# EAGLE design RGB Matrix (EAGLE 6.4)
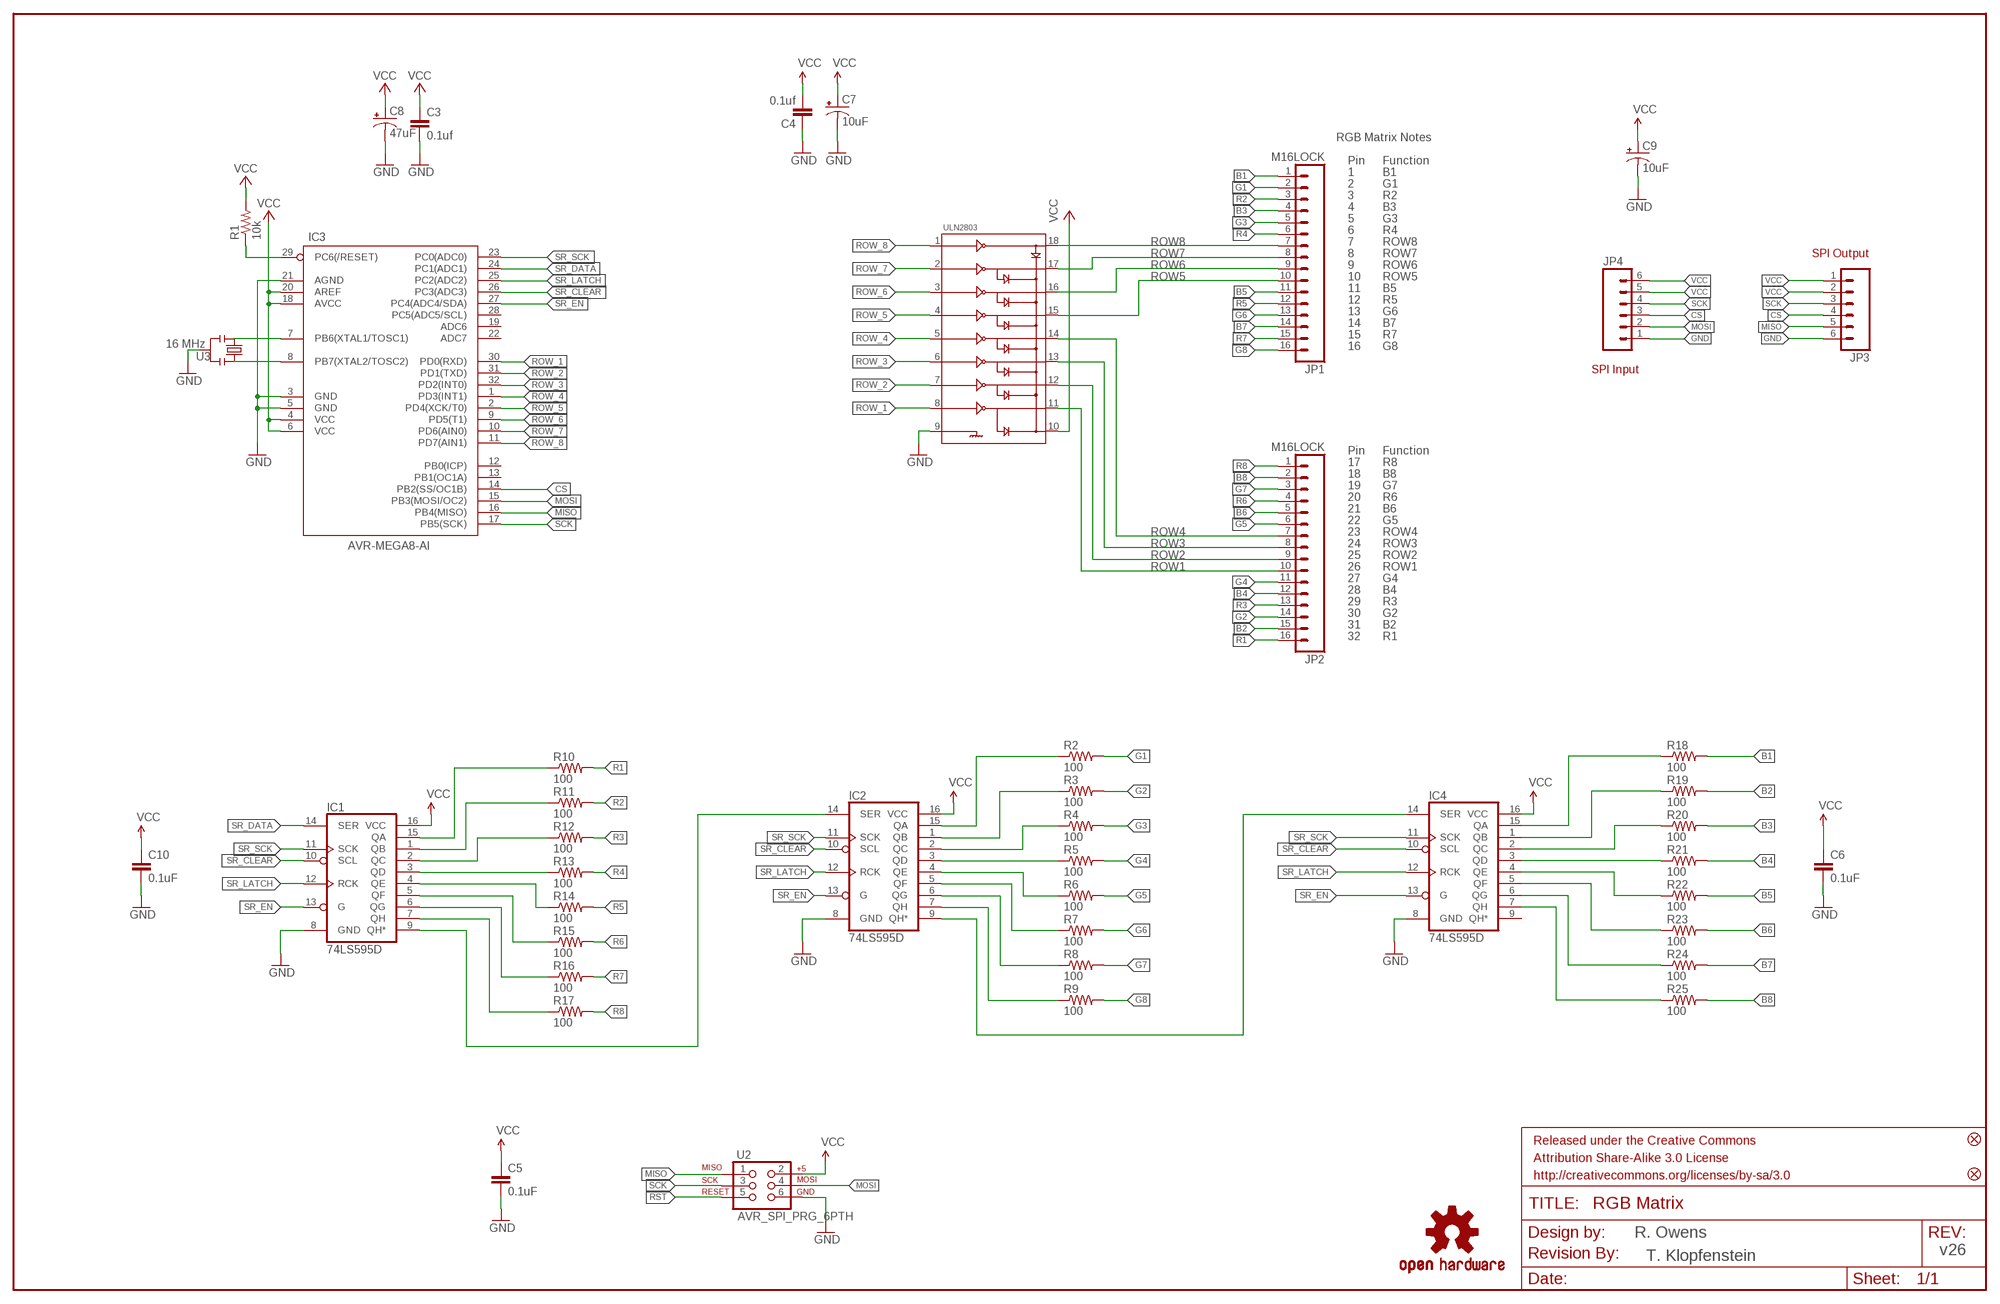
[diagram p0: schematic, sheet 1]

## Parts
C3  0.1uf  CAP0603-CAP  [0603-CAP]
C4  0.1uf  CAP0603-CAP  [0603-CAP]
C5  0.1uF  CAP0603-CAP  [0603-CAP]
C6  0.1uF  CAP0603-CAP  [0603-CAP]
C7  10uF  CAP_POL1206  [EIA3216]
C8  47uF  CAP_POL3528  [EIA3528]
C9  10uF  CAP_POL1206  [EIA3216]
C10  0.1uF  CAP0603-CAP  [0603-CAP]
FRAME1  FRAME-LEDGER  [CREATIVE_COMMONS]
IC1  74LS595D  [SO16]
IC2  74LS595D  [SO16]
IC3  AVR-MEGA8-AI  [TQFP32-08]
IC4  74LS595D  [SO16]
JP1  M16LOCK  [1X16_LOCK]
JP2  M16LOCK  [1X16_LOCK]
JP3  M06SMD  [1X06-SMD]
JP4  M06LOCK  [1X06_LOCK]
LOGO1  OSHW-LOGOL  [OSHW-LOGO-L]
R1  10k  RESISTOR0603-RES  [0603-RES]
R2  100  RESISTOR0603-RES  [0603-RES]
R3  100  RESISTOR0603-RES  [0603-RES]
R4  100  RESISTOR0603-RES  [0603-RES]
R5  100  RESISTOR0603-RES  [0603-RES]
R6  100  RESISTOR0603-RES  [0603-RES]
R7  100  RESISTOR0603-RES  [0603-RES]
R8  100  RESISTOR0603-RES  [0603-RES]
R9  100  RESISTOR0603-RES  [0603-RES]
R10  100  RESISTOR0603-RES  [0603-RES]
R11  100  RESISTOR0603-RES  [0603-RES]
R12  100  RESISTOR0603-RES  [0603-RES]
R13  100  RESISTOR0603-RES  [0603-RES]
R14  100  RESISTOR0603-RES  [0603-RES]
R15  100  RESISTOR0603-RES  [0603-RES]
R16  100  RESISTOR0603-RES  [0603-RES]
R17  100  RESISTOR0603-RES  [0603-RES]
R18  100  RESISTOR0603-RES  [0603-RES]
R19  100  RESISTOR0603-RES  [0603-RES]
R20  100  RESISTOR0603-RES  [0603-RES]
R21  100  RESISTOR0603-RES  [0603-RES]
R22  100  RESISTOR0603-RES  [0603-RES]
R23  100  RESISTOR0603-RES  [0603-RES]
R24  100  RESISTOR0603-RES  [0603-RES]
R25  100  RESISTOR0603-RES  [0603-RES]
U2  AVR_SPI_PRG_6PTH  [2X3]
U3  16 MHz  RESONATORSMD  [RESONATOR-SMD]
U$1  FIDUCIAL1X2  [FIDUCIAL-1X2]
U$2  REVISION  [REVISION]
U$3  FIDUCIAL1X2  [FIDUCIAL-1X2]
ULN2803  ULN2803SOICW  [SO18L]

## Nets
B1: JP1.1 R18.2
B2: JP2.15 R19.2
B3: JP1.4 R20.2
B4: JP2.12 R21.2
B5: JP1.11 R22.2
B6: JP2.5 R23.2
B7: JP1.14 R24.2
B8: JP2.2 R25.2
CS: IC3.14(PB2(SS/OC1B)) JP3.4 JP4.3
G1: JP1.2 R2.2
G2: JP2.14 R3.2
G3: JP1.5 R4.2
G4: JP2.11 R5.2
G5: JP2.6 R6.2
G6: JP1.13 R7.2
G7: JP2.3 R8.2
G8: JP1.16 R9.2
GND [power]: C3.2 C4.1 C5.2 C6.2 C7.C(-) C8.C(-) C9.C(-) C10.2 IC1.8(GND) IC2.8(GND) IC3.3(GND) IC3.5(GND) IC3.21(AGND) IC4.8(GND) JP3.6 JP4.1 U2.6 U3.2 ULN2803.9
MISO: IC3.16(PB4(MISO)) JP3.5 U2.1
MOSI: IC3.15(PB3(MOSI/OC2)) JP4.2 U2.4
N$1: IC3.7(PB6(XTAL1/TOSC1)) U3.1
N$2: IC3.8(PB7(XTAL2/TOSC2)) U3.3
N$11: IC1.9(QH*) IC2.14(SER)
N$12: IC1.15(QA) R10.1
N$13: IC1.1(QB) R11.1
N$14: IC1.2(QC) R12.1
N$15: IC1.3(QD) R13.1
N$16: IC2.9(QH*) IC4.14(SER)
N$18: IC1.4(QE) R14.1
N$19: IC1.5(QF) R15.1
N$20: IC1.6(QG) R16.1
N$21: IC1.7(QH) R17.1
N$22: IC2.15(QA) R2.1
N$23: IC2.1(QB) R3.1
N$24: IC2.2(QC) R4.1
N$25: IC2.3(QD) R5.1
N$26: IC2.4(QE) R6.1
N$27: IC2.5(QF) R7.1
N$28: IC2.6(QG) R8.1
N$29: IC2.7(QH) R9.1
N$32: IC4.15(QA) R18.1
N$33: IC4.1(QB) R19.1
N$34: IC4.2(QC) R20.1
N$35: IC4.3(QD) R21.1
N$36: IC4.4(QE) R22.1
N$37: IC4.5(QF) R23.1
N$38: IC4.6(QG) R24.1
N$39: IC4.7(QH) R25.1
R1: JP2.16 R10.2
R2: JP1.3 R11.2
R3: JP2.13 R12.2
R4: JP1.6 R13.2
R5: JP1.12 R14.2
R6: JP2.4 R15.2
R7: JP1.15 R16.2
R8: JP2.1 R17.2
ROW1 [power]: JP2.10 ULN2803.11
ROW2 [power]: JP2.9 ULN2803.12
ROW3 [power]: JP2.8 ULN2803.13
ROW4 [power]: JP2.7 ULN2803.14
ROW5 [power]: JP1.10 ULN2803.15
ROW6 [power]: JP1.9 ULN2803.16
ROW7 [power]: JP1.8 ULN2803.17
ROW8 [power]: JP1.7 ULN2803.18
ROW_1: IC3.30(PD0(RXD)) ULN2803.8
ROW_2: IC3.31(PD1(TXD)) ULN2803.7
ROW_3: IC3.32(PD2(INT0)) ULN2803.6
ROW_4: IC3.1(PD3(INT1)) ULN2803.5
ROW_5: IC3.2(PD4(XCK/T0)) ULN2803.4
ROW_6: IC3.9(PD5(T1)) ULN2803.3
ROW_7: IC3.10(PD6(AIN0)) ULN2803.2
ROW_8: IC3.11(PD7(AIN1)) ULN2803.1
RST: IC3.29(PC6(/RESET)) R1.1 U2.5
SCK: IC3.17(PB5(SCK)) JP3.3 JP4.4 U2.3
SR_CLEAR: IC1.10(SCL) IC2.10(SCL) IC3.26(PC3(ADC3)) IC4.10(SCL)
SR_DATA: IC1.14(SER) IC3.24(PC1(ADC1))
SR_EN: IC1.13(G) IC2.13(G) IC3.27(PC4(ADC4/SDA)) IC4.13(G)
SR_LATCH: IC1.12(RCK) IC2.12(RCK) IC3.25(PC2(ADC2)) IC4.12(RCK)
SR_SCK: IC1.11(SCK) IC2.11(SCK) IC3.23(PC0(ADC0)) IC4.11(SCK)
VCC [power]: C3.1 C4.2 C5.1 C6.1 C7.A(+) C8.A(+) C9.A(+) C10.1 IC1.16(VCC) IC2.16(VCC) IC3.4(VCC) IC3.6(VCC) IC3.18(AVCC) IC3.20(AREF) IC4.16(VCC) JP3.1 JP3.2 JP4.5 JP4.6 R1.2 U2.2 ULN2803.10
Unconnected: IC3.12(PB0(ICP)) IC3.13(PB1(OC1A)) IC3.19(ADC6) IC3.22(ADC7) IC3.28(PC5(ADC5/SCL)) IC4.9(QH*)

## Notes on the sheet
- RGB Matrix Notes
- Pin | Function
- 1 | B1
- 2 | G1
- 3 | R2
- 4 | B3
- 5 | G3
- 6 | R4
- 7 | ROW8
- 8 | ROW7 | SPI Output
- 9 | ROW6
- 10 | ROW5
- 11 | B5
- 12 | R5
- 13 | G6
- 14 | B7
- 15 | R7
- 16 | G8
- SPI Input
- Pin | Function
- 17 | R8
- 18 | B8
- 19 | G7
- 20 | R6
- 21 | B6
- 22 | G5
- 23 | ROW4
- 24 | ROW3
- 25 | ROW2
- 26 | ROW1
- 27 | G4
- 28 | B4
- 29 | R3
- 30 | G2
- 31 | B2
- 32 | R1
- R. Owens
- v26
- T. Klopfenstein

## Library data of the parts
C3-C6 C10 = SparkFun-Passives:CAP: Capacitor Standard 0603 ceramic capacitor, and 0.1" leaded capacitor.
C7-C9 = SparkFun:CAP_POL: Capacitor Polarized These are standard SMD and PTH capacitors. Normally 10uF, 47uF, and 100uF in electrolytic and tantalum varieties. Always verify the external diameter of the through hole cap, it varies with capacity, voltage, and manufacturer. The EIA devices should be standard.
FRAME1 = SparkFun-Aesthetics:FRAME-LEDGER: Schematic Frame Standard 11x14 US Ledger frame
IC1 IC2 IC4 = SparkFun:74*595: 8-bit SHIFT REGISTER, output latch
IC3 = SparkFun:AVR-MEGA8: MICROCONTROLLER 8 Kbytes FLASH 1 kbytes SRAM 512 bytes EEPROM USART 6-channel 10 bit ADC 2-channel 8 bit ADC
JP1 JP2 = SparkFun-Connectors:M16: 1x16 .1" header
JP3 = SparkFun:M06: Header 6 Standard 6-pin 0.1" header. Use with straight break away headers (SKU : PRT-00116), right angle break away headers (PRT-00553), swiss pins (PRT-00743), machine pins (PRT-00117), and female headers (PRT-00115). Molex polarized connector foot print use with SKU : PRT-08094 with associated crimp pins and housings. NOTES ON THE VARIANTS LOCK and LOCK_LONGPADS... This footprint was designed to help hold the alignment of a through-hole component (i.e. 6-pin header) while soldering it into place. You may notice that each hole has been shifted either up or down by 0.005 of an inch from it's more standard position (which is a perfectly straight line). This slight alteration caused the pins (the squares in the middle) to touch the edges of the holes. Because they are alternating, it causes a "brace" to hold the component in place. 0.005 has proven to be the perfect amount of "off-center" position when using our standard breakaway headers. Although looks a little odd when you look at the bare footprint, once you have a header in there, the alteration is very hard to notice. Also, if you push a header all the way into place, it is covered up entirely on the bottom side. This idea of altering the position of holes to aid alignment will be further integrated into the Sparkfun Library for other footprints. It can help hold any component with 3 or more connection pins.
JP4 = SparkFun-Connectors:M06: Header 6 Standard 6-pin 0.1" header. Use with straight break away headers (SKU : PRT-00116), right angle break away headers (PRT-00553), swiss pins (PRT-00743), machine pins (PRT-00117), and female headers (PRT-00115). Molex polarized connector foot print use with SKU : PRT-08094 with associated crimp pins and housings. NOTES ON THE VARIANTS LOCK and LOCK_LONGPADS... This footprint was designed to help hold the alignment of a through-hole component (i.e. 6-pin header) while soldering it into place. You may notice that each hole has been shifted either up or down by 0.005 of an inch from it's more standard position (which is a perfectly straight line). This slight alteration caused the pins (the squares in the middle) to touch the edges of the holes. Because they are alternating, it causes a "brace" to hold the component in place. 0.005 has proven to be the perfect amount of "off-center" position when using our standard breakaway headers. Although looks a little odd when you look at the bare footprint, once you have a header in there, the alteration is very hard to notice. Also, if you push a header all the way into place, it is covered up entirely on the bottom side. This idea of altering the position of holes to aid alignment will be further integrated into the Sparkfun Library for other footprints. It can help hold any component with 3 or more connection pins.
LOGO1 = SparkFun-Aesthetics:OSHW-LOGO: Open Source Hardware Logo This logo indicates the piece of hardware it is found on incorporates a OSHW license and/or adheres to the definition of open source hardware found here: http://freedomdefined.org/OSHW
R1-R25 = SparkFun-Passives:RESISTOR: Resistor Basic schematic elements and footprints for 0603, 1206, and PTH resistors.
U2 = SparkFun:AVR_SPI_PRG_6: AVR ISP 6 Pin This is the reduced ISP connector for AVR programming. Common on Arduino. This footprint will take up less PCB space and can be used with a 10-pin to 6-pin adapter such as SKU: BOB-08508
U3 = SparkFun:RESONATOR: Resonator Small SMD resonator. This is the itty bitty 10/20MHz resonators with built in caps. CSTCE10M0G55 and CSTCE20M0V53. Footprint has been reviewed closely but hasn't been tested yet.
U$1 U$3 = SparkFun:FIDUCIAL: Fiducial Alignment Points Various fiducial points for machine vision alignment.
U$2 = SparkFun-Aesthetics:REVISION
ULN2803 = SparkFun:ULN2803: Darlington Driver ULN2803 Darlington array. 500mA max per channel, 8-channel package. Spark Fun Electronics SKU : COM-00312

## Net classes
0 default: width 0.203 mm
1 power: width 0.203 mm

## Board
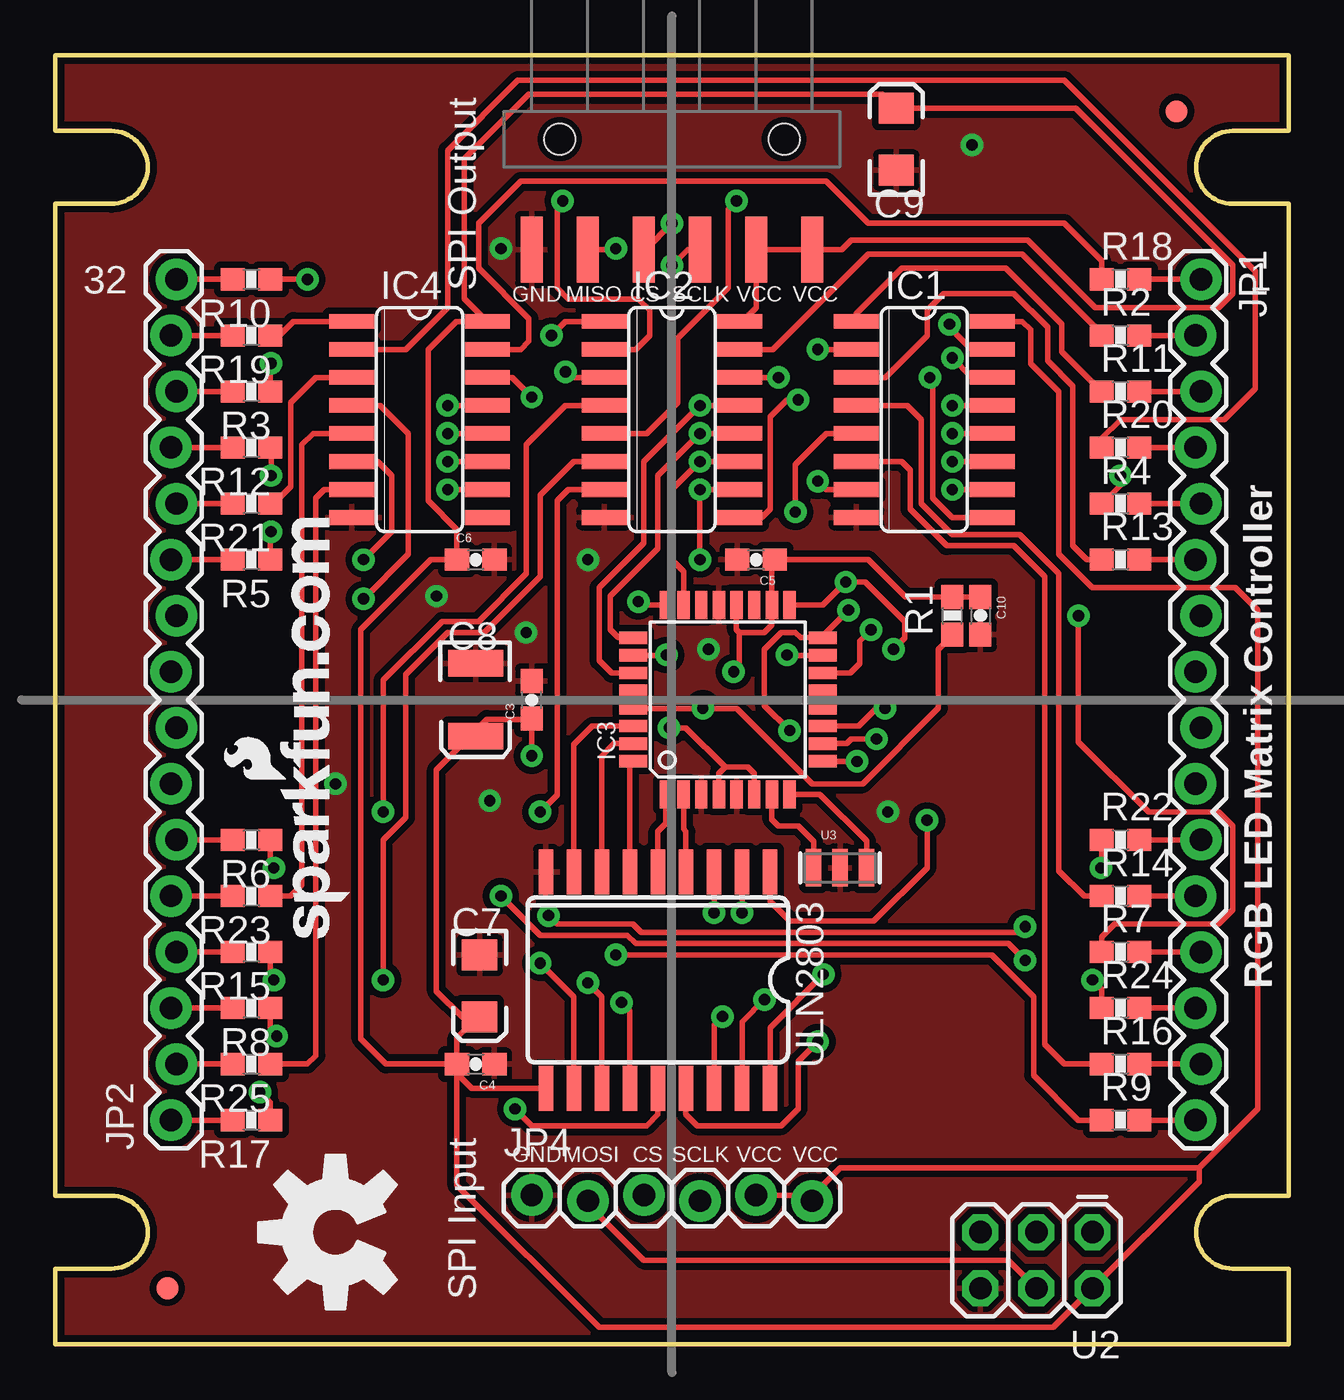
[diagram p1: board, top side]
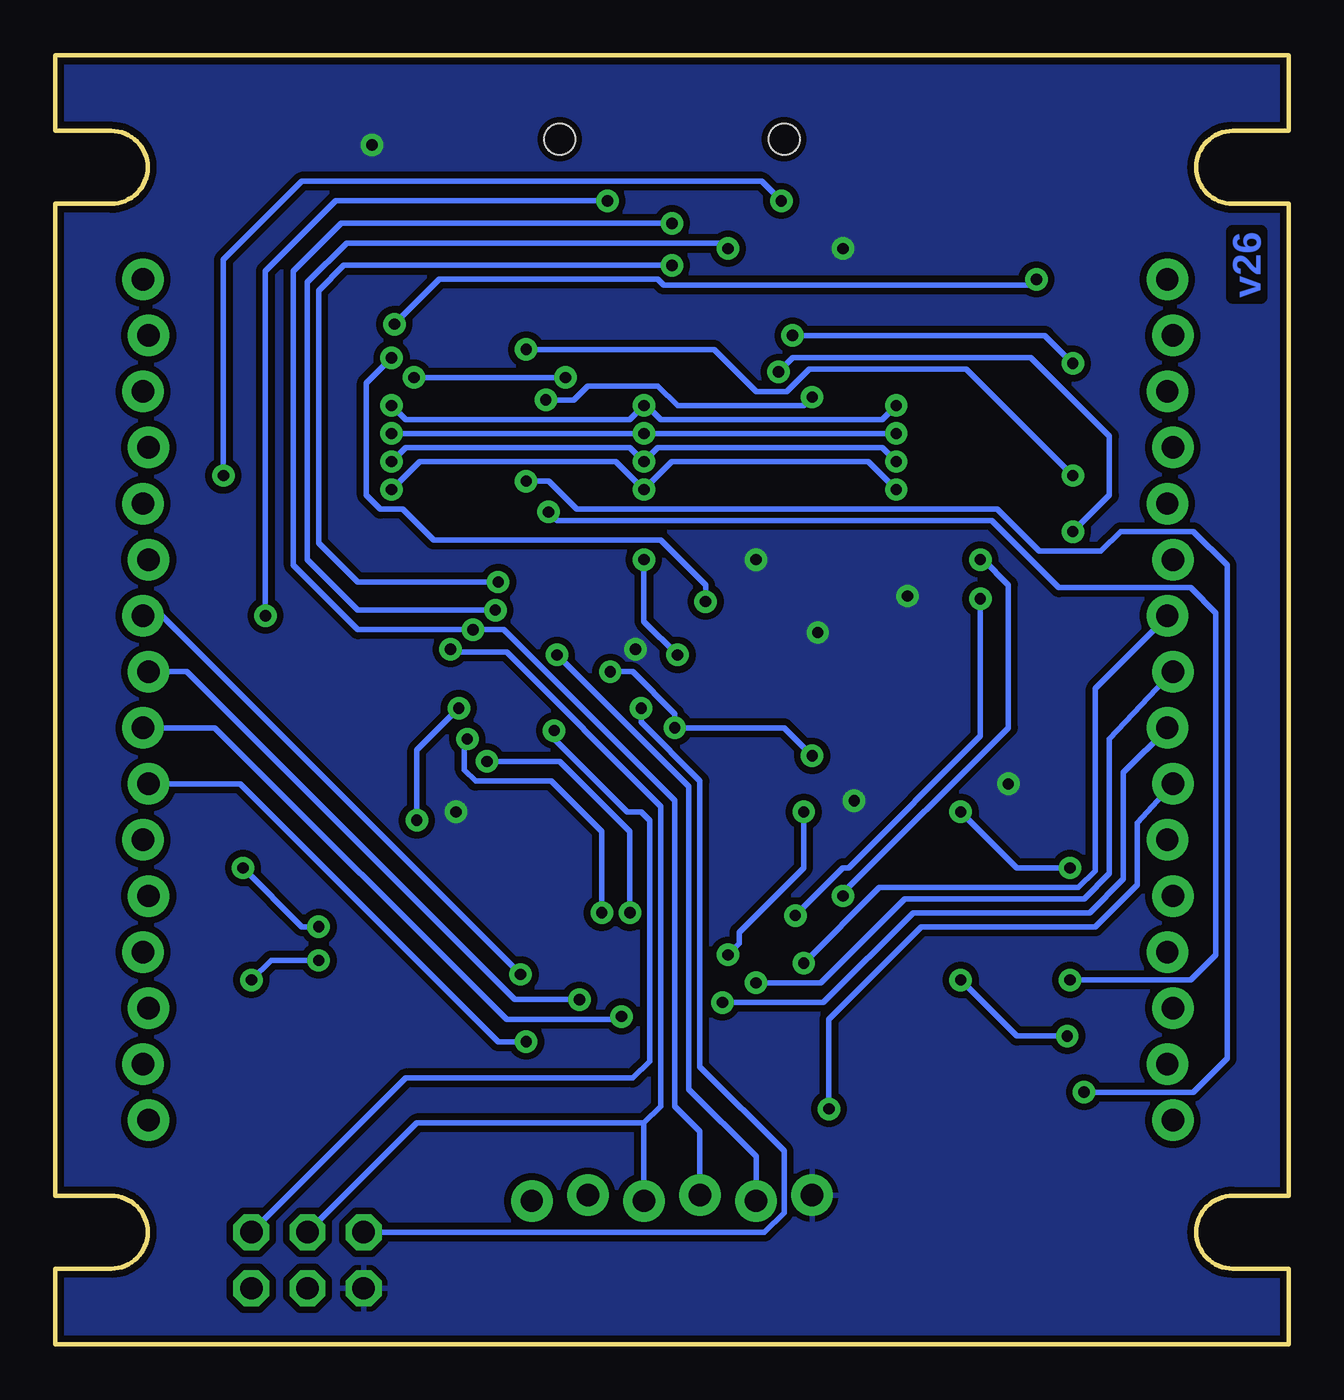
[diagram p2: board, bottom side, seen from below]

Size 55.88 x 58.42 mm. Coordinates in mm from the lower left corner, seen from the top.
Outline: 55.88,0 55.88,3.43 53.34,3.43 arc-180 53.34,6.73 55.88,6.73 55.88,51.69 53.34,51.69 arc-180 53.34,54.99 55.88,54.99 55.88,58.42 0,58.42 0,54.99 2.54,54.99 arc-180 2.54,51.69 0,51.69 0,6.73 2.54,6.73 arc-180 2.54,3.43 0,3.43 0,0 55.88,0
Copper layers (1*16): Top 0.035mm / dielectric 1.5mm / Bottom 0.035mm
Design rules "SparkFun": minimum track width 8mil, minimum drill 20mil, track to track 8mil, track to pad 8mil, pad to pad 8mil, via to via 8mil, smd to smd 8mil, copper to edge 10mil, drill to drill 8mil, minimum pad ring 12mil, minimum via ring 10mil, stop-mask expansion 4mil, vias tented up to drill 25mil, thermal gap 10mil

### Footprints (pad centres in the part's own frame; a part is rotated, then mirrored left to right if it is on the bottom)
0603-CAP = smd 1.1 x 1: 1 -0.85,0; 2 0.85,0
EIA3216 = smd 1.4 x 1.6: A 1.4,0; C -1.4,0
EIA3528 = smd 1.2 x 2.5: A 1.65,0; C -1.65,0
SO16 = smd 0.66 x 2.032: 1 -4.445,-3.073; 2 -3.175,-3.073; 3 -1.905,-3.073; 4 -0.635,-3.073; 5 0.635,-3.073; 6 1.905,-3.073; 7 3.175,-3.073; 8 4.445,-3.073; 9 4.445,3.073; 10 3.175,3.073; 11 1.905,3.073; 12 0.635,3.073; 13 -0.635,3.073; 14 -1.905,3.073; 15 -3.175,3.073; 16 -4.445,3.073
TQFP32-08 = smd 1.27 x 0.559: 1 -4.293,2.8; 2 -4.293,2; 3 -4.293,1.2; 4 -4.293,0.4; 5 -4.293,-0.4; 6 -4.293,-1.2; 7 -4.293,-2; 8 -4.293,-2.8; 17 4.293,-2.8; 18 4.293,-2; 19 4.293,-1.2; 20 4.293,-0.4; 21 4.293,0.4; 22 4.293,1.2; 23 4.293,2; 24 4.293,2.8 | smd 0.559 x 1.27: 9 -2.8,-4.293; 10 -2,-4.293; 11 -1.2,-4.293; 12 -0.4,-4.293; 13 0.4,-4.293; 14 1.2,-4.293; 15 2,-4.293; 16 2.8,-4.293; 25 2.8,4.293; 26 2,4.293; 27 1.2,4.293; 28 0.4,4.293; 29 -0.4,4.293; 30 -1.2,4.293; 31 -2,4.293; 32 -2.8,4.293
1X16_LOCK = drill 1.016 pad 1.88: 1 0,0.127; 2 2.54,-0.127; 3 5.08,0.127; 4 7.62,-0.127; 5 10.16,0.127; 6 12.7,-0.127; 7 15.24,0.127; 8 17.78,-0.127; 9 20.32,0.127; 10 22.86,-0.127; 11 25.4,0.127; 12 27.94,-0.127; 13 30.48,0.127; 14 33.02,-0.127; 15 35.56,0.127; 16 38.1,-0.127
1X06-SMD = smd 1 x 3: 1 -6.35,5; 2 -3.81,5; 3 -1.27,5; 4 1.27,5; 5 3.81,5; 6 6.35,5 | hole 1.4: -5.08,0; 5.08,0
1X06_LOCK = drill 1.016 pad 1.88: 1 0,0; 2 2.54,-0.254; 3 5.08,0; 4 7.62,-0.254; 5 10.16,0; 6 12.7,-0.254
0603-RES = smd 1.1 x 1: 1 -0.85,0; 2 0.85,0
2X3 = drill 1.016 octagon: 1 0,0; 2 0,2.54; 3 2.54,0; 4 2.54,2.54; 5 5.08,0; 6 5.08,2.54
RESONATOR-SMD = smd 0.7 x 1.7: 1 -1.2,0; 2 0,0; 3 1.2,0
FIDUCIAL-1X2 = smd 1 x 1: 1 0,0
SO18L = smd 0.66 x 2.032: 1 -0.635,-4.902; 2 0.635,-4.902; 3 1.905,-4.902; 4 3.175,-4.902; 5 4.445,-4.902; 6 5.715,-4.902; 7 6.985,-4.902; 8 8.255,-4.902; 9 9.525,-4.902; 10 9.525,4.902; 11 8.255,4.902; 12 6.985,4.902; 13 5.715,4.902; 14 4.445,4.902; 15 3.175,4.902; 16 1.905,4.902; 17 0.635,4.902; 18 -0.635,4.902

### Placement (x,y rotation side)
C3  21.59,29.21 90 top
C4  19.05,12.7 180 top
C5  31.75,35.56 180 top
C6  19.05,35.56 0 top
C7  19.23,16.24 270 top
C8  19.05,29.21 270 top
C9  38.1,54.61 90 top
C10  41.91,33.02 270 top
FRAME1  -2.07,-16.51 0 top  (outside the outline)
IC1  39.37,41.91 270 top
IC2  27.94,41.91 270 top
IC3  30.47,29.22 90 top
IC4  16.51,41.91 270 top
JP1  51.77,48.26 270 top
JP2  5.38,10.16 90 top
JP3  27.94,54.61 180 top
JP4  21.59,6.76 0 top
LOGO1  12.7,5.08 90 top
R1  40.64,33.02 90 top
R2  48.26,45.72 0 top
R3  8.89,43.18 180 top
R4  48.26,38.1 0 top
R5  8.89,35.56 180 top
R6  8.89,22.86 180 top
R7  48.26,17.78 0 top
R8  8.89,15.24 180 top
R9  48.26,10.16 0 top
R10  8.89,48.26 180 top
R11  48.26,43.18 0 top
R12  8.89,40.64 180 top
R13  48.26,35.56 0 top
R14  48.26,20.32 0 top
R15  8.89,17.78 180 top
R16  48.26,12.7 0 top
R17  8.89,10.16 180 top
R18  48.26,48.26 0 top
R19  8.89,45.72 180 top
R20  48.26,40.64 0 top
R21  8.89,38.1 180 top
R22  48.26,22.86 0 top
R23  8.89,20.32 180 top
R24  48.26,15.24 0 top
R25  8.89,12.7 180 top
U2  46.99,5.08 180 top
U3  35.56,21.59 0 top
U$1  5.08,2.54 90 top
U$2  8.89,-20.32 0 top  (outside the outline)
U$3  50.8,55.88 90 top
U$8  [SFE-NEW-WEBLOGO]  13.34,18.41 90 top
ULN2803  31.75,16.51 180 top

### Tracks (layer width: path | path; a pad name or v marks a point on that pad's centre or on a via)
B1
  Top 0.254: R18.2 JP1.1
B2
  Top 0.254: JP2.15 R19.2
B3
  Top 0.254: R20.2 JP1.4
B4
  Top 0.254: JP2.12 R21.2
B5
  Top 0.254: R22.2 JP1.11
B6
  Top 0.254: JP2.5 R23.2
B7
  Top 0.254: R24.2 JP1.14
B8
  Top 0.254: JP2.2 R25.2
CS  (via drill 0.51)
  Top 0.254: IC3.14 36.01,30.42 36.45,30.86 36.45,31.88 v36.96,32.38 | JP3.4 26.75,49.61 v27.94,50.8
  Bottom 0.254: v27.94,50.8 42.93,50.8 45.09,48.64 45.09,35.31 42.16,32.38 v36.96,32.38 35.56,32.38 27.81,24.64 27.81,10.79 26.67,9.65 JP4.3
G1
  Top 0.254: R2.2 JP1.2
G2
  Top 0.254: JP2.14 R3.2
G3
  Top 0.254: R4.2 JP1.5
G4
  Top 0.254: JP2.11 R5.2
G5
  Top 0.254: JP2.6 R6.2
G6
  Top 0.254: R7.2 JP1.13
G7
  Top 0.254: JP2.3 R8.2
G8
  Top 0.254: R9.2 JP1.16
GND  (via drill 0.51)
  other vias: 20.19,49.66 17.27,33.91 24.13,35.56 29.59,31.5 41.53,54.36 21.34,32.26 12.7,25.4 19.68,24.64 37.72,24.13
  pour Bottom (isolate 0.305): 55.88,0 55.88,58.42 0,58.42 0,0
  pour Top (isolate 0.305): 55.88,0 55.88,58.42 0,58.42 0,0
MISO  (via drill 0.51)
  Top 0.254: v35.94,33.27 34.76,32.1 IC3.16 33.77,32.02 33.53,32.26 32.89,32.26 32.13,31.5 32.13,28.96 v33.27,27.81 | JP3.5 25.35,49.61 v25.4,49.66
  Bottom 0.254: v35.94,33.27 42.16,33.27 44.45,35.56 44.45,48.13 42.67,49.91 25.65,49.91 v25.4,49.66 | v33.27,27.81 33.27,27.43 29.97,24.13 29.34,24.13 28.96,23.75 28.96,12.83 29.72,12.06 40.01,12.06 U2.1
MOSI  (via drill 0.51)
  Top 0.254: IC3.15 33.17,31.22 v33.15,31.24 | U2.4 43.18,3.81 26.67,3.81 24.13,6.35 JP4.2
  Bottom 0.254: v33.15,31.24 27.18,25.27 27.18,11.56 24.13,8.51 JP4.2 24.13,6.73
N$1
  Top 0.254: IC3.7 32.47,23.79 32.77,23.5 33.66,23.5 34.36,22.79 U3.1
N$2
  Top 0.254: U3.3 36.76,22.8 34.64,24.93 IC3.8
N$11  (via drill 0.51)
  Top 0.254: IC1.9 40.64,37.47 39.75,38.35 39.75,43.69 v39.62,43.81 | IC2.14 v32.77,43.81
  Bottom 0.254: v32.77,43.81 v39.62,43.81
N$12  (via drill 0.51)
  Top 0.254: IC1.15 41.53,45.09 40.51,46.1 v40.51,46.23 | R10.1 v11.43,48.26
  Bottom 0.254: v40.51,46.23 38.48,48.26 28.57,48.26 28.32,48.01 11.68,48.01 v11.43,48.26
N$13
  Top 0.254: R11.1 45.59,45 45.59,46.23 43.05,48.77 38.35,48.77 36.3,46.71 IC1.1
N$14  (via drill 0.51)
  Top 0.254: v34.54,45.09 IC1.2 | R12.1 9.78,40.6 v9.78,39.37
  Bottom 0.254: v34.54,45.09 26.04,45.09 24.13,43.18 22.73,43.18 21.72,44.2 14.61,44.2 v9.78,39.37
N$15
  Top 0.254: R13.1 46.74,35.56 46.1,36.2 46.1,43.43 44.96,44.58 44.96,46.1 43.43,47.62 40.26,47.62 39.5,46.86 39.5,45.72 37.59,43.81 IC1.3
N$16  (via drill 0.51)
  Top 0.254: IC4.14 20.7,43.81 v21.59,42.93 | v33.66,42.8 33.15,42.8 32.38,42.04 32.38,37.85 32,37.47 IC2.9
  Bottom 0.254: v21.59,42.93 21.97,42.55 27.69,42.55 28.57,43.43 31.75,43.43 32.38,42.8 v33.66,42.8
N$18
  Top 0.254: R14.1 46.61,20.32 45.47,21.46 45.47,34.92 43.69,36.7 40.64,36.7 39.24,38.1 39.24,41.91 38.61,42.55 IC1.4
N$19  (via drill 0.51)
  Top 0.254: IC1.5 34.92,41.27 33.53,39.88 v33.53,37.72 | R15.1 9.74,16.68 v9.91,16.51
  Bottom 0.254: v33.53,37.72 33.15,37.34 13.46,37.34 10.41,34.29 4.45,34.29 3.3,33.15 3.3,17.65 4.45,16.51 v9.91,16.51
N$20
  Top 0.254: IC1.6 38.35,40.01 38.73,39.62 38.73,37.85 40.39,36.2 43.43,36.2 44.83,34.8 44.83,13.59 45.72,12.7 R16.1
N$21  (via drill 0.51)
  Top 0.254: IC1.7 34.92,38.73 v34.54,39.12 | R17.1 9.74,10.96 v9.27,11.43
  Bottom 0.254: v34.54,39.12 33.53,39.12 32.26,37.85 13.21,37.85 11.3,35.94 8.51,35.94 7.62,36.83 4.32,36.83 2.79,35.31 2.79,12.95 4.32,11.43 v9.27,11.43
N$22
  Top 0.254: IC2.15 32.51,45.09 36.83,49.4 43.81,49.4 47.41,45.81 R2.1
N$23  (via drill 0.51)
  Top 0.254: IC2.1 23.11,46.35 v22.48,45.72 | R3.1 9.74,44.41 v9.78,44.45
  Bottom 0.254: v22.48,45.72 11.05,45.72 v9.78,44.45
N$24  (via drill 0.51)
  Top 0.254: IC2.2 26.29,45.09 26.92,45.72 26.92,46.86 26.42,47.37 23.24,47.37 22.73,47.88 22.73,51.56 v22.99,51.82 | R4.1 48.26,38.95 v48.26,39.37
  Bottom 0.254: v22.99,51.82 23.88,52.7 44.7,52.7 48.26,49.15 v48.26,39.37
N$25  (via drill 0.51)
  Top 0.254: R5.1 9.74,36.79 v9.78,36.83 | IC2.3 23.37,43.81 v23.11,44.07
  Bottom 0.254: v9.78,36.83 8.13,38.48 8.13,41.15 11.68,44.7 22.48,44.7 v23.11,44.07
N$26  (via drill 0.51)
  Top 0.254: v14.86,24.13 14.86,30.1 17.53,32.77 19.18,32.77 21.34,34.92 21.34,40.77 23.11,42.55 IC2.4 24.89,42.55 | R6.1 9.74,21.76 v9.91,21.59
  Bottom 0.254: v14.86,24.13 12.32,21.59 v9.91,21.59
N$27  (via drill 0.51)
  Top 0.254: IC2.5 26.8,41.27 28.19,42.67 28.19,45.59 30.48,47.88 30.48,51.44 v30.86,51.82 | v46.35,33.02 46.35,27.3 49.53,24.13 52.7,24.13 53.34,23.5 53.34,19.68 52.7,19.05 48.01,19.05 47.41,18.45 R7.1
  Bottom 0.254: v46.35,33.02 46.35,48.64 43.18,51.82 v30.86,51.82
N$28  (via drill 0.51)
  Top 0.254: v14.86,16.51 14.86,22.86 15.88,23.88 15.88,30.35 17.78,32.26 19.43,32.26 21.97,34.8 21.97,38.48 23.5,40.01 IC2.6 | R8.1 9.74,14.26 v10.03,13.97
  Bottom 0.254: v14.86,16.51 12.32,13.97 v10.03,13.97
N$29  (via drill 0.51)
  Top 0.254: IC2.7 23.24,38.73 22.73,38.23 22.73,24.89 v21.97,24.13 | R9.1 46.35,10.16 44.32,12.19 44.32,15.75 42.42,17.65 v25.4,17.65
  Bottom 0.254: v21.97,24.13 21.97,21.59 24.89,18.67 24.89,18.16 v25.4,17.65
N$32
  Top 0.254: IC4.15 20.32,45.09 | 20.32,45.09 20.45,45.09 | 38.1,50.8 36.83,50.8 34.92,52.7 21.08,52.7 19.18,50.8 19.18,48.77 21.46,46.48 21.46,45.47 21.08,45.09 20.32,45.09 | 38.1,50.8 38.35,50.8 | R18.1 47.41,49.11 45.72,50.8 38.1,50.8
N$33
  Top 0.254: R19.1 10.16,45.72 10.79,46.35 IC4.1
N$34
  Top 0.254: IC4.2 15.88,45.09 17.78,46.99 17.78,54.1 20.95,57.28 45.72,57.28 54.36,48.64 54.36,43.31 52.96,41.91 48.26,41.91 47.41,41.06 R20.1
N$35
  Top 0.254: IC4.3 11.81,43.81 10.67,42.67 10.67,38.86 9.91,38.1 R21.1
N$36  (via drill 0.51)
  Top 0.254: IC4.4 14.73,42.55 16,41.27 16,35.81 v13.97,33.78 | R22.1 47.41,21.63 v47.37,21.59 | v22.35,19.43 22.73,19.05 26.16,19.05 26.54,18.67 43.69,18.67 v43.94,18.92
  Bottom 0.254: v13.97,33.78 13.97,27.56 19.94,21.59 20.19,21.59 v22.35,19.43 | v43.94,18.92 44.7,18.92 v47.37,21.59
N$37
  Top 0.254: R23.1 10.67,20.32 11.18,20.83 11.18,40.77 11.68,41.27 IC4.5
N$38  (via drill 0.51)
  Top 0.254: IC4.6 14.61,40.01 15.24,39.37 15.24,36.83 v13.97,35.56 | R24.1 47.41,16.09 v46.99,16.51 | v20.19,20.32 21.97,18.54 25.91,18.54 26.29,18.16 43.18,18.16 v43.94,17.4
  Bottom 0.254: v20.19,20.32 20.19,20.45 12.7,27.94 12.7,34.42 13.84,35.56 v13.97,35.56 | v43.94,17.4 46.1,17.4 v46.99,16.51
N$39
  Top 0.254: R25.1 11.43,12.7 11.81,13.08 11.81,38.35 12.19,38.73 IC4.7
R1
  Top 0.254: JP2.16 R10.2
R2
  Top 0.254: R11.2 JP1.3
R3
  Top 0.254: JP2.13 R12.2
R4
  Top 0.254: R13.2 JP1.6
R5
  Top 0.254: R14.2 JP1.12
R6
  Top 0.254: JP2.4 R15.2
R7
  Top 0.254: R16.2 JP1.15
R8
  Top 0.254: JP2.1 R17.2
ROW1  (via drill 0.51)
  Top 0.254: ULN2803.11 23.5,15.75 v21.97,17.27
  Bottom 0.254: v21.97,17.27 18.54,20.7 9.53,20.7 8.76,21.46 8.76,29.34 8.76,29.72 5.46,33.02 JP2.10
ROW2  (via drill 0.51)
  Top 0.254: ULN2803.12 24.77,15.75 v24.13,16.38
  Bottom 0.254: JP2.9 8.13,27.43 8.13,21.34 9.27,20.19 17.4,20.19 21.21,16.38 v24.13,16.38
ROW3  (via drill 0.51)
  Top 0.254: ULN2803.13 26.04,15.11 v25.65,15.49
  Bottom 0.254: v25.65,15.49 21.08,15.49 17.02,19.56 9.02,19.56 7.49,21.08 7.49,25.65 7.49,25.91 5.46,27.94 JP2.8
ROW4  (via drill 0.51)
  Top 0.254: ULN2803.14 27.3,10.41 26.8,9.91 21.59,9.91 v20.83,10.67
  Bottom 0.254: v20.83,10.67 20.83,14.73 16.64,18.92 8.76,18.92 6.86,20.83 6.86,23.62 JP2.7
ROW5  (via drill 0.51)
  Top 0.254: ULN2803.15 28.57,10.41 29.08,9.91 32.89,9.91 33.66,10.67 33.66,12.83 v34.54,13.72
  Bottom 0.254: v34.54,13.72 35.81,13.72 47.5,25.4 JP1.10
ROW6  (via drill 0.51)
  Top 0.254: ULN2803.16 29.84,14.48 v30.23,14.86
  Bottom 0.254: v30.23,14.86 30.35,14.73 35.43,14.73 48.64,27.94 JP1.9
ROW7  (via drill 0.51)
  Top 0.254: ULN2803.17 31.11,14.61 v32.13,15.62
  Bottom 0.254: v32.13,15.62 35.05,15.62 49.91,30.48 JP1.8
ROW8  (via drill 0.51)
  Top 0.254: ULN2803.18 32.38,14.35 v34.8,16.76
  Bottom 0.254: v34.8,16.76 51.05,33.02 JP1.7
ROW_1
  Top 0.254: IC3.30 24.34,28.02 23.5,27.18 ULN2803.8
ROW_2
  Top 0.254: IC3.31 25.32,27.22 24.77,26.67 ULN2803.7
ROW_3
  Top 0.254: IC3.32 26.04,26.28 ULN2803.6
ROW_4
  Top 0.254: IC3.1 27.67,23.61 27.3,23.24 ULN2803.5
ROW_5
  Top 0.254: IC3.2 28.47,23.35 28.57,23.24 ULN2803.4
ROW_6  (via drill 0.51)
  Top 0.254: IC3.9 v36.32,26.42 | v29.84,19.56 ULN2803.3
  Bottom 0.254: v36.32,26.42 33.02,26.42 29.84,23.24 v29.84,19.56
ROW_7  (via drill 0.51)
  Top 0.254: IC3.10 35.86,27.22 36.07,27.43 v37.21,27.43 | v31.11,19.56 ULN2803.2
  Bottom 0.254: v37.21,27.43 37.34,27.3 37.34,26.04 36.83,25.53 33.4,25.53 31.11,23.24 v31.11,19.56
ROW_8  (via drill 0.51)
  Top 0.254: IC3.11 36.4,28.02 37.21,28.83 v37.59,28.83 | ULN2803.1 32.38,20.07 33.27,19.18 37.08,19.18 39.5,21.59 v39.5,23.75
  Bottom 0.254: v39.5,23.75 39.5,26.92 v37.59,28.83
RST  (via drill 0.51)
  Top 0.254: IC3.29 29.33,28.82 v29.34,28.83 v29.35,28.82 30.87,28.82 34.29,25.4 36.58,25.4 40.01,28.83 40.01,31.5 40.64,32.13 R1.1
  Bottom 0.254: v29.34,28.83 29.34,28.19 26.67,25.53 26.67,12.57 22.86,8.76 22.86,5.97 23.75,5.08 U2.5
SCK  (via drill 0.51)
  Top 0.254: IC3.17 34.78,33.51 v35.81,34.54 36.7,34.54 38.48,32.77 38.48,32 v37.97,31.5 | JP3.3 28.66,49.61 v27.94,48.9
  Bottom 0.254: v35.81,34.54 42.16,34.54 43.94,36.32 43.94,47.75 42.8,48.9 v27.94,48.9 | 29.21,10.03 28.45,10.79 28.45,24.38 35.43,31.37 37.85,31.37 v37.97,31.5 | 29.21,10.03 39.5,10.03 U2.3 | JP4.4 29.21,10.03
SR_CLEAR  (via drill 0.51)
  Top 0.254: IC4.10 v17.78,38.73 | v40.64,38.73 IC1.10 | IC2.10 v29.21,38.73 v29.21,35.56 | IC3.26 27.66,31.22 v27.69,31.24
  Bottom 0.254: v17.78,38.73 19.05,40.01 27.94,40.01 v29.21,38.73 30.48,40.01 39.37,40.01 v40.64,38.73 | v27.69,31.24 29.21,32.77 v29.21,35.56
SR_DATA  (via drill 0.51)
  Top 0.254: IC3.24 26.56,33.51 v26.42,33.66 | IC1.14 41.53,43.81 v40.64,44.7
  Bottom 0.254: v26.42,33.66 26.42,34.42 28.45,36.45 38.73,36.45 40.13,37.85 41.15,37.85 41.78,38.48 41.78,43.56 v40.64,44.7
SR_EN  (via drill 0.51)
  Top 0.254: v17.78,42.55 IC4.13 | v40.64,42.55 IC1.13 | IC2.13 v29.21,42.55 26.67,40.01 26.67,36.32 24.64,34.29 24.64,30.99 25.21,30.42 IC3.27
  Bottom 0.254: v17.78,42.55 18.41,41.91 28.45,41.91 29.08,42.55 v29.21,42.55 | v29.21,42.55 29.21,42.42 | v29.21,42.55 29.84,41.91 40.01,41.91 v40.64,42.55
SR_LATCH  (via drill 0.51)
  Top 0.254: v17.78,41.27 IC4.12 | v40.64,41.27 IC1.12 | IC2.12 v29.21,41.27 27.3,39.37 27.3,36.07 25.15,33.91 25.15,32.38 25.51,32.02 IC3.25
  Bottom 0.254: v17.78,41.27 v29.21,41.27 v40.64,41.27
SR_SCK  (via drill 0.51)
  Top 0.254: IC4.11 v17.78,40.01 | v40.64,40.01 IC1.11 | IC2.11 v29.21,40.01 27.94,38.73 27.94,35.56 28.47,35.03 IC3.23
  Bottom 0.254: v17.78,40.01 18.41,40.64 28.57,40.64 v29.21,40.01 29.84,40.64 40.01,40.64 v40.64,40.01
VCC  (via drill 0.51)
  Top 0.254: IC2.16 31.11,46.35 31.75,46.99 JP3.2 33.96,49.61 34.04,49.53 34.12,49.61 JP3.1 35.64,49.61 36.07,50.04 44.07,50.04 47.12,46.99 52.7,46.99 53.34,47.62 53.34,48.9 46.23,56.01 38.73,56.01 C9.A 37.47,56.64 21.46,56.64 18.54,53.72 18.54,47.4 IC4.16 18.16,46.35 16.89,45.09 16.89,38.23 18.2,36.92 C6.1 17.02,35.56 13.84,32.38 13.84,13.84 14.99,12.7 C4.2 | 30.99,32.26 32.13,32.26 32.47,32.6 IC3.18 32.47,35.39 32.64,35.56 C5.1 36.83,35.56 38.52,33.87 R1.2 40.68,33.87 40.77,33.78 40.85,33.87 C10.1 41.87,33.87 41.78,33.78 41.7,33.87 | 30.99,32.26 30.86,32.38 30.86,33.15 30.87,33.16 IC3.20 | IC3.4 30.07,25.88 30.35,26.16 | IC3.6 31.67,25.86 31.37,26.16 30.35,26.16 | C4.2 18.2,13.88 19.16,14.84 C7.A 18.43,14.84 17.27,16 17.27,26.04 19.05,27.81 | ULN2803.10 18.87,11.61 18.2,12.28 | 19.05,27.81 C8.A | 18.2,12.28 18.2,7.2 24.64,0.76 45.21,0.76 U2.2 51.82,7.37 51.82,8 | 18.2,12.28 C4.2 | IC1.16 43.81,46.35 44.2,45.97 44.2,44.45 45.47,43.18 45.47,35.81 46.99,34.29 53.47,34.29 54.48,33.27 54.48,10.67 51.82,8 | 30.35,26.16 28.57,27.94 v27.81,27.94 | 21.59,28.32 v21.59,26.67 | 30.99,32.26 30.99,30.73 v30.73,30.48 | 21.59,28.32 C3.1 | 19.05,27.81 19.56,28.32 21.59,28.32 | 51.82,8 35.56,8 34.31,6.76 JP4.6 34.29,6.73 34.27,6.76 JP4.5
  Bottom 0.254: v21.59,26.67 22.86,27.94 v27.81,27.94 27.81,28.57 29.72,30.48 v30.73,30.48

### Text on the board
Bottom: v26
tPlace: 32 | SPI Output | 1 | GND | MISO | CS | SCLK | VCC | VCC | RGB LED Matrix Controller | GND | MOSI | CS | SCLK | VCC | VCC | SPI Input
tValues: DNP | ULN2803 | Polarized Male 6 pin header | NOTE: | The two sets of 16 breakout pins | should be populated with Female | breakout headers, mounted on the BACK | side of the board. (i.e. Not the component side) | RGB LED Matrix Controller | R. Owens | T. Klopfenstein
Measures: COLUMN 1 | R1 | B1 | COLUMN 2 | B2 | G1 | G2 | R2 | COLUMN 3 | R3 | B3 | G3 | B4 | G4 | R4 | ROW8 | COLUMN 4 | ROW1 | ROW2 | ROW7 | ROW3 | ROW6 | COLUMN 5 | ROW4 | ROW5 | G5 | B5 | B6 | R5 | COLUMN 6 | R6 | G6 | G7 | B7 | B8 | R7 | COLUMN 7 | R8 | G8 | COLUMN 8 | ROW 8 | ROW 7 | ROW 6 | ROW 5 | ROW 4 | ROW 3 | ROW 2 | ROW 1